# EAGLE design finalSchematics (EAGLE 7.2.0)

## Sheet 1 of 2: PWR
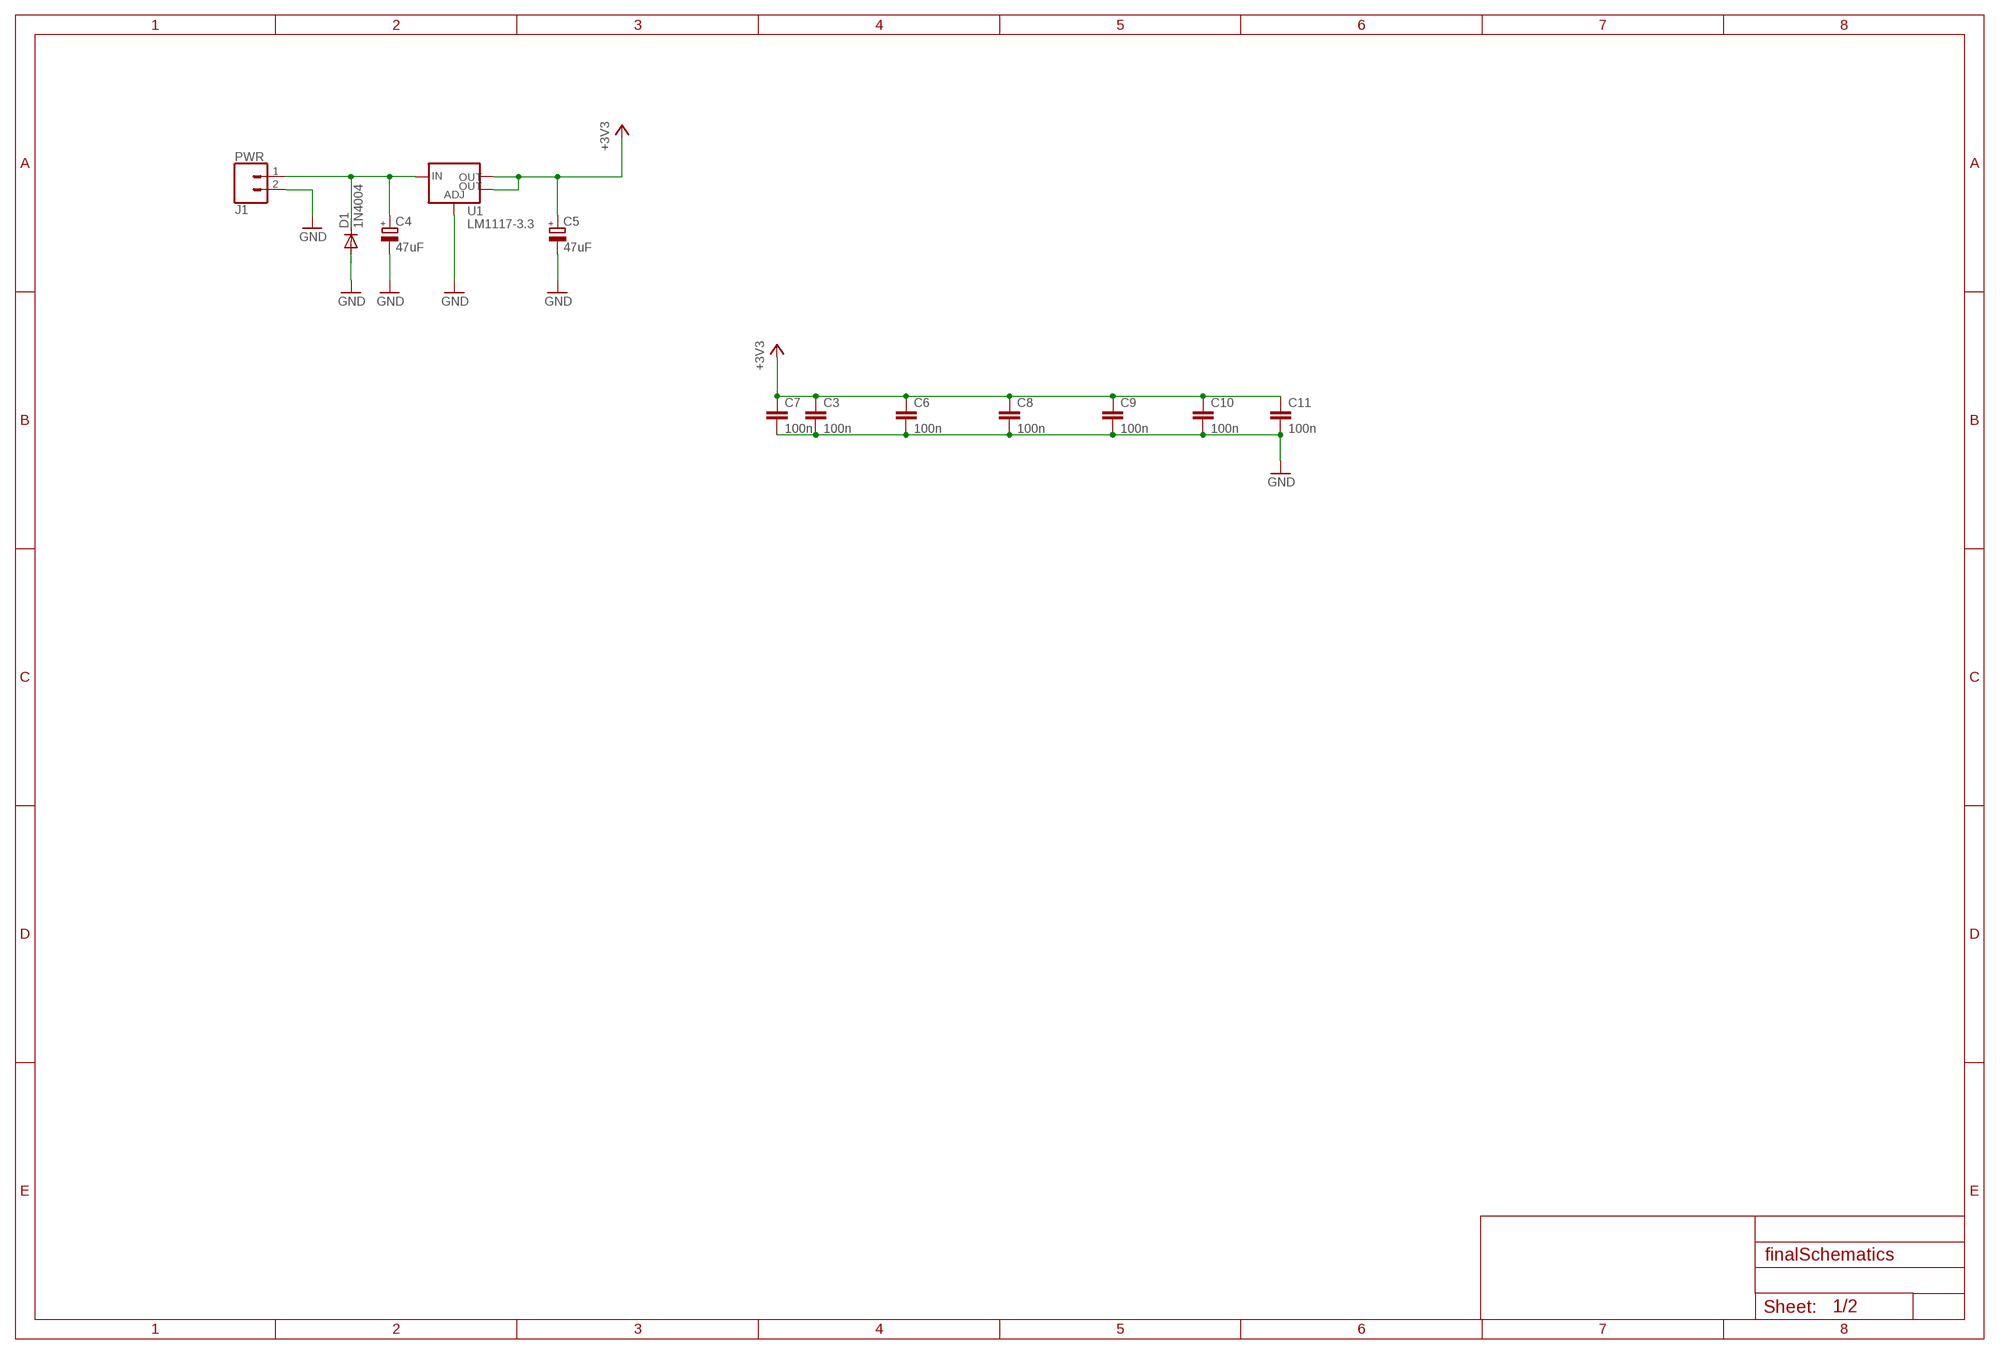
[diagram p0: schematic, sheet 1]

### Parts
C3  100n  C-EUC0805  [C0805]
C4  47uF  CPOL-EU153CLV-0810  [153CLV-0810]
C5  47uF  CPOL-EU153CLV-0810  [153CLV-0810]
C6  100n  C-EUC0805  [C0805]
C7  100n  C-EUC0805  [C0805]
C8  100n  C-EUC0805  [C0805]
C9  100n  C-EUC0805  [C0805]
C10  100n  C-EUC0805  [C0805]
C11  100n  C-EUC0805  [C0805]
D1  1N4004  [DO41-10]
J1  PWR  CONN_02  [1X02]
U1  LM1117-3.3  V_REG_LM1117SOT223  [SOT223]

### Nets
+3V3: C3.1 C5.+ C6.1 C7.1 C8.1 C9.1 C10.1 C11.1 U1.2(OUT) U1.4(OUT) ; also sheet 2
GND: C3.2 C4.- C5.- C6.2 C7.2 C8.2 C9.2 C10.2 C11.2 D1.A J1.2 U1.1(ADJ) ; also sheet 2
N$3: C4.+ D1.C J1.1 U1.3(IN)

## Sheet 2 of 2: MCU
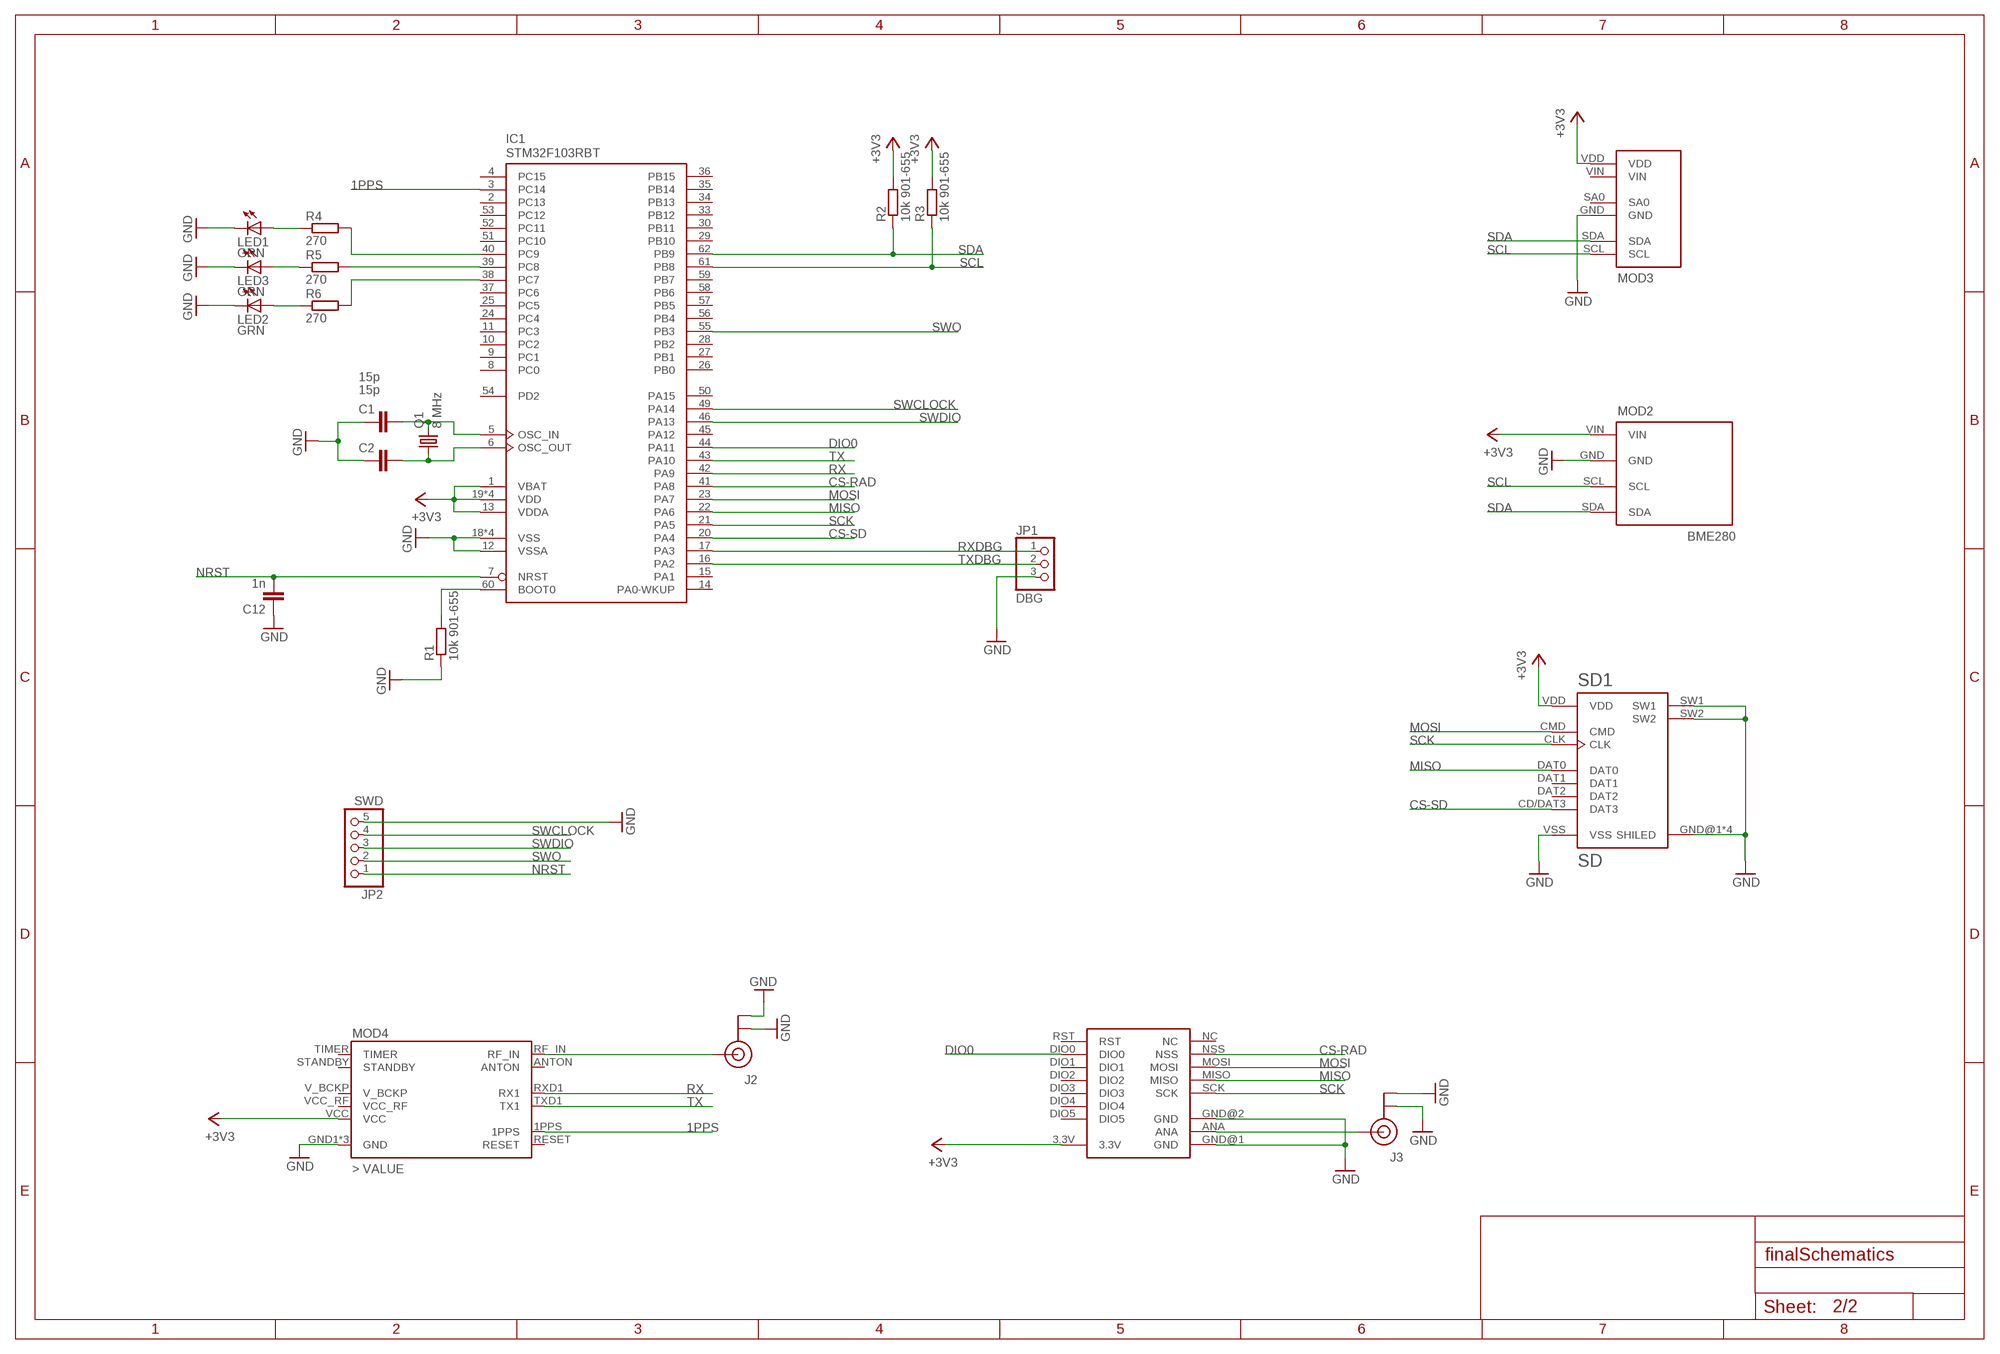
[diagram p1: schematic, sheet 2]

### Parts
C1  15p  C-EUC0805  [C0805]
C2  15p  C-EUC0805  [C0805]
C12  1n  C-EUC0805  [C0805]
IC1  STM32F103RBT  [LQFP64]
J2  U.FL  [U.FL]
J3  U.FL  [U.FL]
JP1  DBG  PINHD-1X3  [1X03]
JP2  SWD  PINHD-1X5  [1X05]
LED1  GRN  LEDCHIP-LED0603  [CHIP-LED0603]
LED2  GRN  LEDCHIP-LED0603  [CHIP-LED0603]
LED3  GRN  LEDCHIP-LED0603  [CHIP-LED0603]
MOD2  BME280  [BME280]
MOD3  IMU04A  [IMU04A]
MOD4  GPS  L70B-GPS  [L70B-GPS]
Q1  8 MHz  CRYSTALHC49UP  [HC49UP]
R1  10k 901-655  R-EU_R0805  [R0805]
R2  10k 901-655  R-EU_R0805  [R0805]
R3  10k 901-655  R-EU_R0805  [R0805]
R4  270  R-EU_R0805  [R0805]
R5  270  R-EU_R0805  [R0805]
R6  270  R-EU_R0805  [R0805]
SD1  SD  [MOLEX-SD-104031]
U$2  RFM69  [20X16BOARD]

### Nets
1PPS: IC1.3(PC14) MOD4.1PPS
+3V3: IC1.1(VBAT) IC1.13(VDDA) IC1.19(VDD) IC1.32(VDD) IC1.48(VDD) IC1.64(VDD) MOD2.VIN MOD3.VDD MOD4.VCC R2.2 R3.2 SD1.VDD U$2.3.3V ; also sheet 1
CS-RAD: IC1.41(PA8) U$2.NSS
CS-SD: IC1.20(PA4) SD1.CD/DAT3(DAT3)
DIO0: IC1.44(PA11) U$2.DIO0
GND: C1.1 C2.1 C12.1 IC1.12(VSSA) IC1.18(VSS) IC1.31(VSS) IC1.47(VSS) IC1.63(VSS) J2.P$1(GND) J2.P$2(GND) J3.P$1(GND) J3.P$2(GND) JP1.3 JP2.5 LED1.C LED2.C LED3.C MOD2.GND MOD3.GND MOD4.GND1(GND) MOD4.GND2(GND) MOD4.GND3(GND) R1.1 SD1.GND@1(SHILED) SD1.GND@2(SHILED) SD1.GND@3(SHILED) SD1.GND@4(SHILED) SD1.SW1 SD1.SW2 SD1.VSS U$2.GND@1(GND) U$2.GND@2(GND) ; also sheet 1
MISO: IC1.22(PA6) SD1.DAT0 U$2.MISO
MOSI: IC1.23(PA7) SD1.CMD U$2.MOSI
N$1: C2.2 IC1.6(OSC_OUT) Q1.1
N$2: C1.2 IC1.5(OSC_IN) Q1.2
N$5: J3.P$3(SIGNAL) U$2.ANA
N$6: J2.P$3(SIGNAL) MOD4.RF_IN
N$7: IC1.38(PC7) R6.2
N$9: IC1.39(PC8) R5.2
N$10: IC1.40(PC9) R4.2
N$11: LED1.A R4.1
N$12: LED2.A R6.1
N$13: LED3.A R5.1
N$14: IC1.60(BOOT0) R1.2
NRST: C12.2 IC1.7(NRST) JP2.1
RX: IC1.42(PA9) MOD4.RXD1(RX1)
RXDBG: IC1.17(PA3) JP1.1
SCK: IC1.21(PA5) SD1.CLK U$2.SCK
SCL: IC1.61(PB8) MOD2.SCL MOD3.SCL R3.1
SDA: IC1.62(PB9) MOD2.SDA MOD3.SDA R2.1
SWCLOCK: IC1.49(PA14) JP2.4
SWDIO: IC1.46(PA13) JP2.3
SWO: IC1.55(PB3) JP2.2
TX: IC1.43(PA10) MOD4.TXD1(TX1)
TXDBG: IC1.16(PA2) JP1.2
Unconnected: IC1.2(PC13) IC1.4(PC15) IC1.8(PC0) IC1.9(PC1) IC1.10(PC2) IC1.11(PC3) IC1.14(PA0-WKUP) IC1.15(PA1) IC1.24(PC4) IC1.25(PC5) IC1.26(PB0) IC1.27(PB1) IC1.28(PB2) IC1.29(PB10) IC1.30(PB11) IC1.33(PB12) IC1.34(PB13) IC1.35(PB14) IC1.36(PB15) IC1.37(PC6) IC1.45(PA12) IC1.50(PA15) IC1.51(PC10) IC1.52(PC11) IC1.53(PC12) IC1.54(PD2) IC1.56(PB4) IC1.57(PB5) IC1.58(PB6) IC1.59(PB7) MOD3.SA0 MOD3.VIN MOD4.ANTON MOD4.RESET MOD4.STANDBY MOD4.TIMER MOD4.V_BCKP MOD4.VCC_RF SD1.DAT1 SD1.DAT2 U$2.DIO1 U$2.DIO2 U$2.DIO3 U$2.DIO4 U$2.DIO5 U$2.RST

## Power pins joined to a net without a drawn wire
NC: U$2.NC

## Library data of the parts
C1-C3 C6-C12 = rcl:C-EU: CAPACITOR, European symbol
C4 C5 = rcl:CPOL-EU: POLARIZED CAPACITOR, European symbol
D1 = diode:1N4004: DIODE general purpose rectifier, 1 A
IC1 = components:STM32F103R*T: ARM 32-bit Cortex™-M3 CPU 72 MHz maximum frequency 16 to 1024 Kbytes of Flash memory 6 to 96 kbytes of SRAM 51 GPIOs 2.0 to 3.6 V application supply
J1 = SparkFun-Connectors:CONN_02: Multi connection point. Often used as Generic Header-pin footprint for 0.1 inch spaced/style header connections On any of the 0.1 inch spaced packages, you can populate with these: Break Away Headers - Straight <https://www.sparkfun.com/products/116> (PRT-00116) Break Away Male Headers - Right Angle <https://www.sparkfun.com/products/553> (PRT-00553) Female Headers <https://www.sparkfun.com/products/115> (PRT-00115) Break Away Headers - Machine Pin <https://www.sparkfun.com/products/117> (PRT-00117) Break Away Female Headers - Swiss Machine Pin <https://www.sparkfun.com/products/743> (PRT-00743) For SCREWTERMINALS and SPRING TERMINALS visit here: Screw Terimnals on SparkFun.com <https://www.sparkfun.com/search/results?term=Screw+Terminals> (5mm/3.5mm/2.54mm spacing) This device is also useful as a general connection point to wire up your design to another part of your project. Our various solder wires solder well into these plated through hole pads. Hook-Up Wire - Assortment (Stranded, 22 AWG) <https://www.sparkfun.com/products/11375> (PRT-11375) Hook-Up Wire - Assortment (Solid Core, 22 AWG) <https://www.sparkfun.com/products/11367> (PRT-11367) View the entire wire category on our website here <https://www.sparkfun.com/categories/141> Special notes: Molex polarized connector foot print use with: PRT-08233 with associated crimp pins and housings. 2.54_SCREWTERM for use with PRT-10571. 3.5mm Screw Terminal footprints for PRT-08084 5mm Screw Terminal footprints for use with PRT-08432
J2 J3 = SparkFun-Connectors:U.FL: SMD Antenna Connector - U.FL 2mm height, 3.0mm x 3.0mm receptacle size. SparkFun Products: SparkFun WiFi Shield - ESP8266 <https://www.sparkfun.com/products/13287> SparkFun ESP8266 Thing <https://www.sparkfun.com/products/13231> SparkFun MiniGen - Pro Mini Signal Generator Shield <https://www.sparkfun.com/products/11420>; PROD_ID: CONN-09193; SF_ID: WRL-09144
JP1 = pinhead:PINHD-1X3: PIN HEADER
JP2 = pinhead:PINHD-1X5: PIN HEADER
LED1-LED3 = led:LED: LED OSRAM: - CHIPLED LG R971, LG N971, LY N971, LG Q971, LY Q971, LO R971, LY R971 LH N974, LH R974 LS Q976, LO Q976, LY Q976 LO Q996 - Hyper CHIPLED LW Q18S LB Q993, LB Q99A, LB R99A - SideLED LS A670, LO A670, LY A670, LG A670, LP A670 LB A673, LV A673, LT A673, LW A673 LH A674 LY A675 LS A676, LA A676, LO A676, LY A676, LW A676 LS A679, LY A679, LG A679 - Hyper Micro SIDELED® LS Y876, LA Y876, LO Y876, LY Y876 LT Y87S - SmartLED LW L88C, LW L88S LB L89C, LB L89S, LG L890 LS L89K, LO L89K, LY L89K LS L896, LA L896, LO L896, LY L896 - TOPLED LS T670, LO T670, LY T670, LG T670, LP T670 LSG T670, LSP T670, LSY T670, LOP T670, LYG T670 LG T671, LOG T671, LSG T671 LB T673, LV T673, LT T673, LW T673 LH T674 LS T676, LA T676, LO T676, LY T676, LB T676, LH T676, LSB T676, LW T676 LB T67C, LV T67C, LT T67C, LS T67K, LO T67K, LY T67K, LW E67C LS E67B, LA E67B, LO E67B, LY E67B, LB E67C, LV E67C, LT E67C LW T67C LS T679, LY T679, LG T679 LS T770, LO T770, LY T770, LG T770, LP T770 LB T773, LV T773, LT T773, LW T773 LH T774 LS E675, LA E675, LY E675, LS T675 LS T776, LA T776, LO T776, LY T776, LB T776 LHGB T686 LT T68C, LB T68C - Hyper Mini TOPLED® LB M676 - Mini TOPLED Santana® LG M470 LS M47K, LO M47K, LY M47K Source: http://www.osram.convergy.de LUXEON: - LUMILED® LXK2-PW12-R00, LXK2-PW12-S00, LXK2-PW14-U00, LXK2-PW14-V00 LXK2-PM12-R00, LXK2-PM12-S00, LXK2-PM14-U00 LXK2-PE12-Q00, LXK2-PE12-R00, LXK2-PE12-S00, LXK2-PE14-T00, LXK2-PE14-U00 LXK2-PB12-K00, LXK2-PB12-L00, LXK2-PB12-M00, LXK2-PB14-N00, LXK2-PB14-P00, LXK2-PB14-Q00 LXK2-PR12-L00, LXK2-PR12-M00, LXK2-PR14-Q00, LXK2-PR14-R00 LXK2-PD12-Q00, LXK2-PD12-R00, LXK2-PD12-S00 LXK2-PH12-R00, LXK2-PH12-S00 LXK2-PL12-P00, LXK2-PL12-Q00, LXK2-PL12-R00 Source: www.luxeon.com KINGBRIGHT: KA-3528ASYC Source: www.kingbright.com
MOD2 = BME280:BME280
MOD3 = IMU:IMU04A
MOD4 = components:L70B-GPS
Q1 = crystal:CRYSTAL: CRYSTAL; OC_FARNELL: unknown; OC_NEWARK: unknown
R1-R3 = rcl:R-EU_: RESISTOR, European symbol
R4-R6 = resistor:R-EU_: RESISTOR, European symbol
SD1 = components:SD
U1 = SparkFun-IC-Power:V_REG_LM1117: Voltage Regulator LM1117 Standard adjustable voltage regulator but in SMD form. Spark Fun Electronics SKU : COM-00595; PROD_ID: VREG-08170
U$2 = RFM69mod:RFM69: RFM69 module

## Board
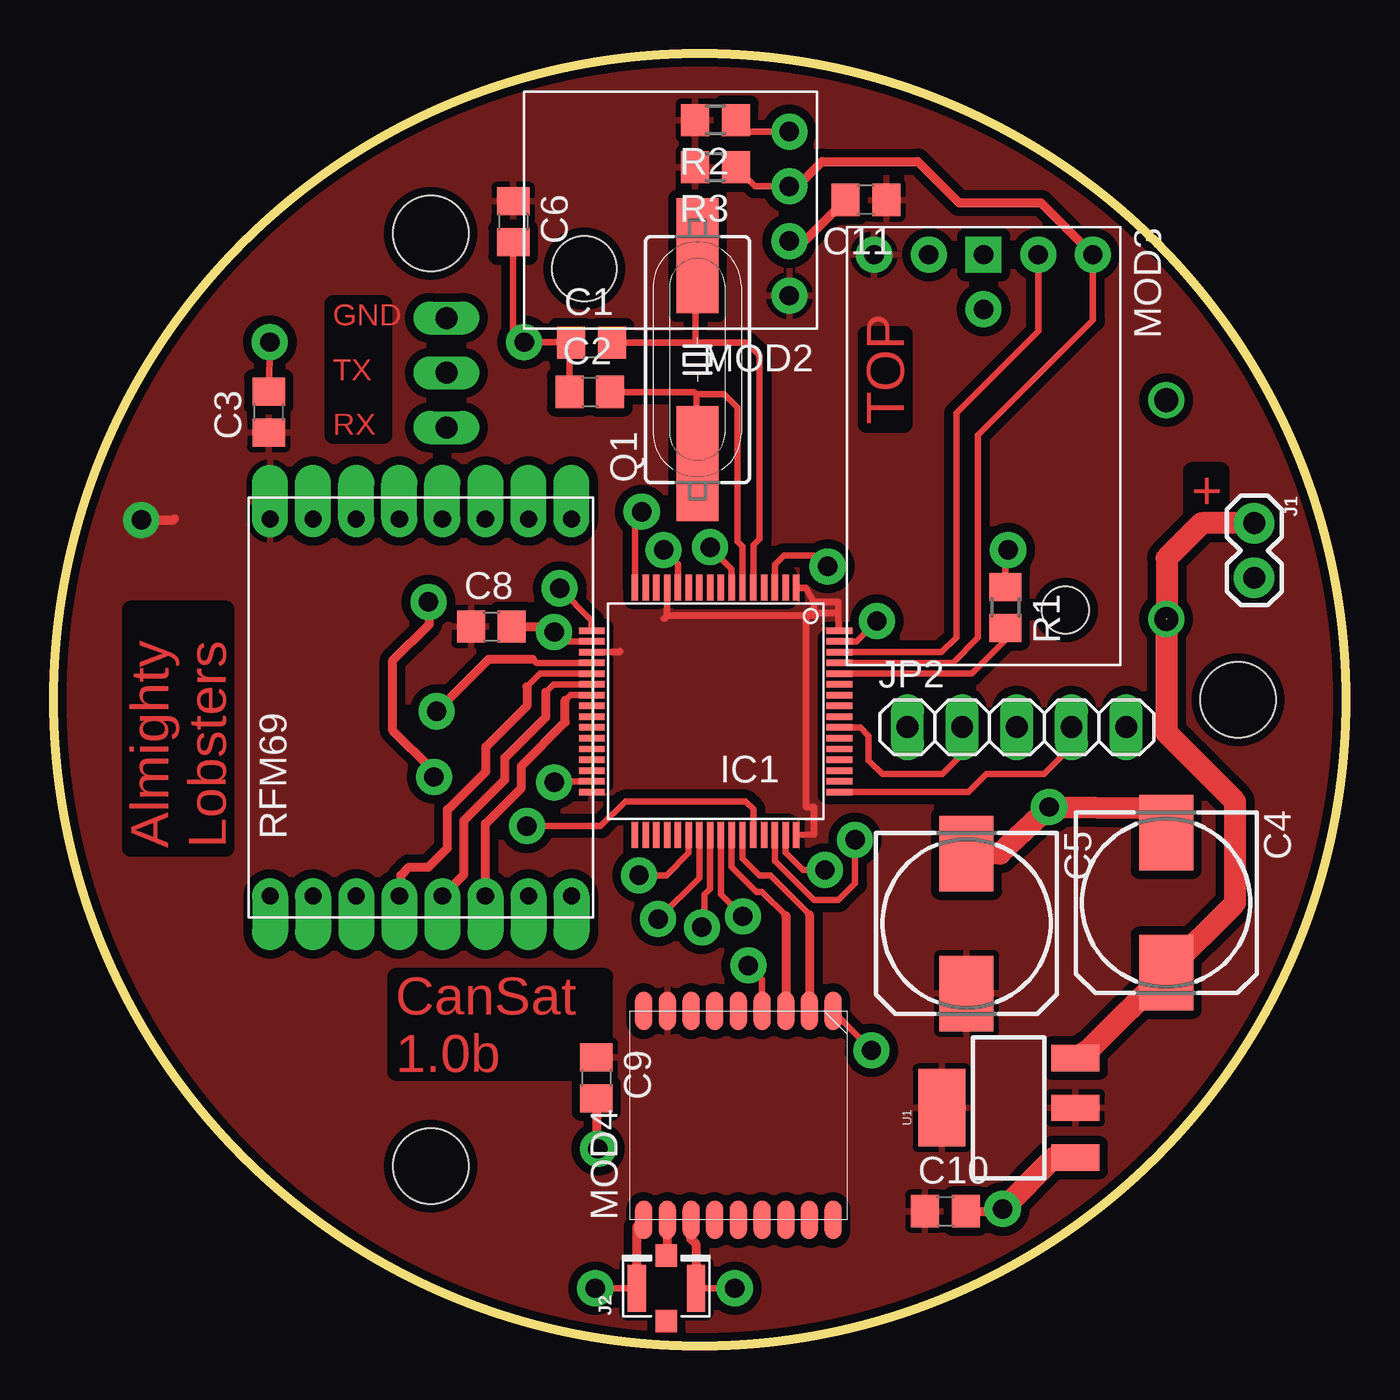
[diagram p2: board, top side]
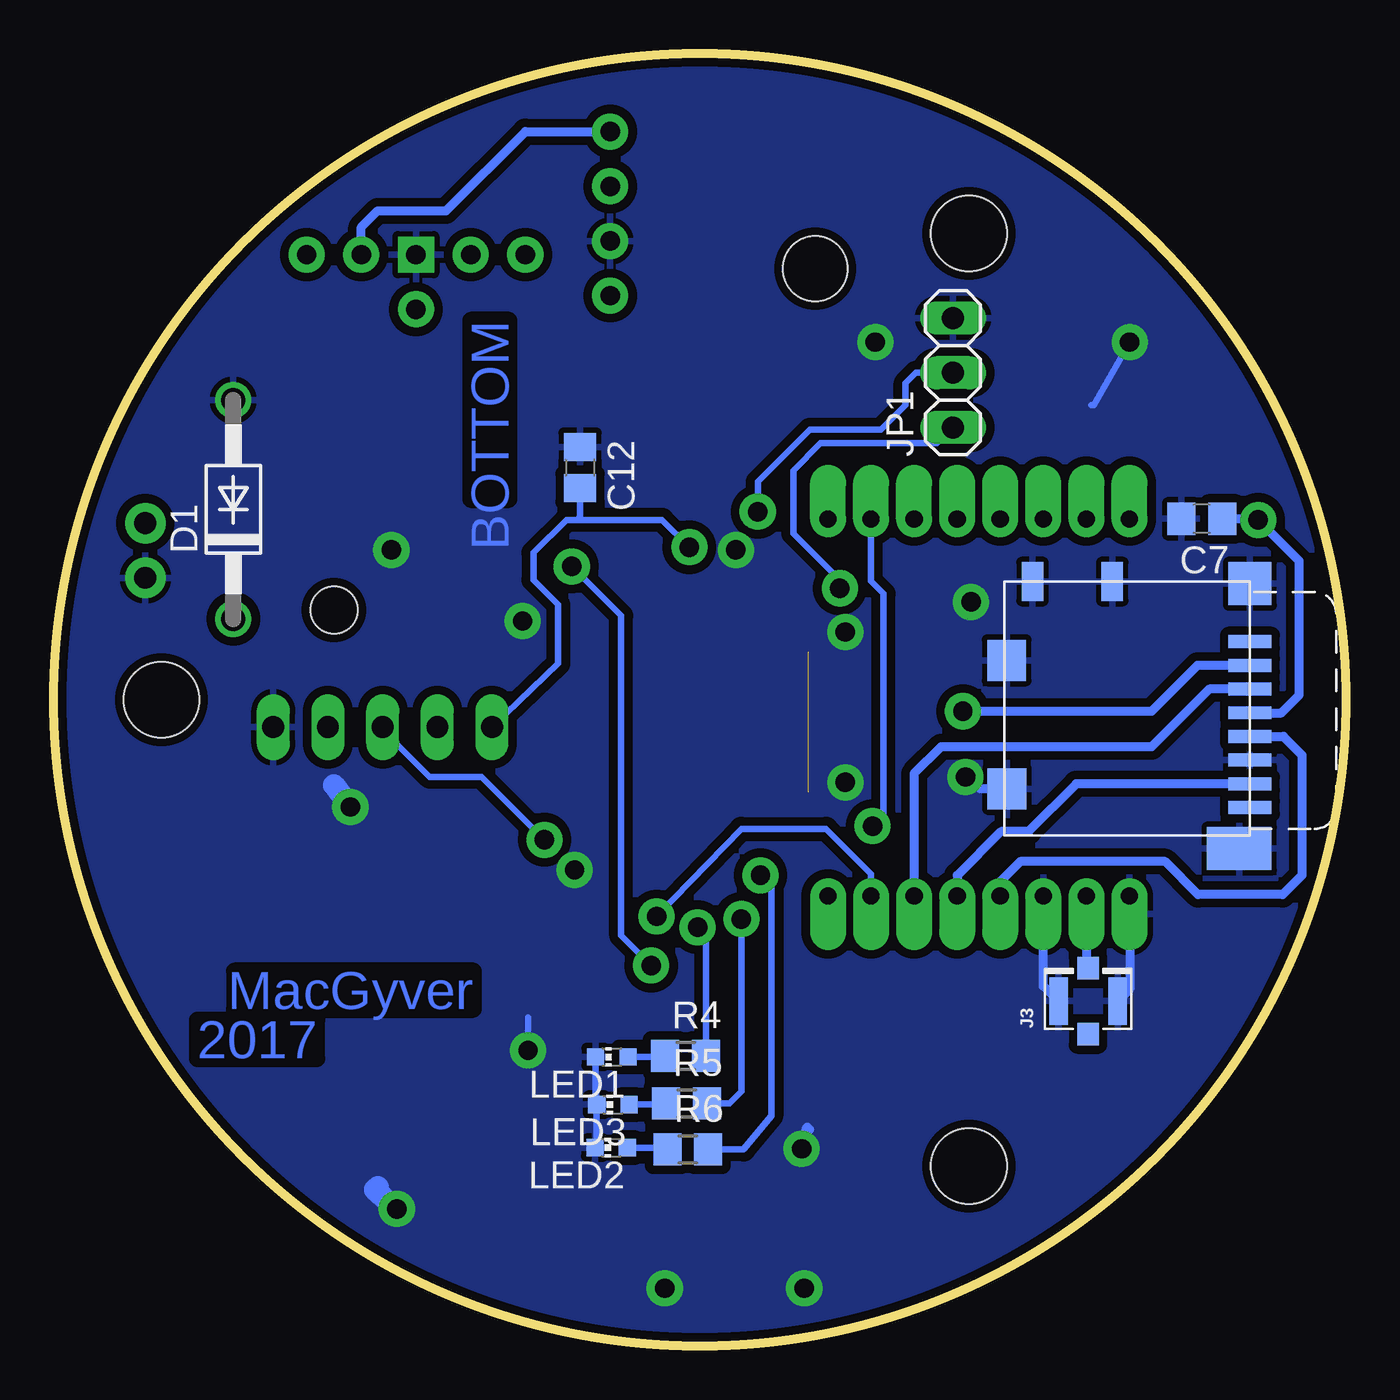
[diagram p3: board, bottom side, seen from below]

Size 60 x 60 mm. Coordinates in mm from the lower left corner, seen from the top.
Outline: circle at 30,30 radius 30
Copper layers (1*16): Top 0.035mm / dielectric 1.5mm / Bottom 0.035mm
Design rules "default *": minimum track width 6mil, minimum drill 0.6mm, track to track 6mil, track to pad 6mil, pad to pad 6mil, via to via 6mil, smd to smd 6mil, copper to edge 12mil, drill to drill 8mil, minimum pad ring 10mil, minimum via ring 8mil, stop-mask expansion 4mil, vias tented up to drill 0mil, thermal gap 10mil
Holes 3.5 mm at 55,30 17.5,51.65 17.5,8.35

### Footprints (pad centres in the part's own frame; a part is rotated, then mirrored left to right if it is on the bottom)
C0805 = smd 1.3 x 1.5: 1 -0.95,0; 2 0.95,0
153CLV-0810 = smd 3.5 x 2.5: + 3.25,0; - -3.25,0
DO41-10 = drill 1.118: A 5.08,0; C -5.08,0
LQFP64 = smd 0.3 x 1.2: 1 -3.75,-5.75; 2 -3.25,-5.75; 3 -2.75,-5.75; 4 -2.25,-5.75; 5 -1.75,-5.75; 6 -1.25,-5.75; 7 -0.75,-5.75; 8 -0.25,-5.75; 9 0.25,-5.75; 10 0.75,-5.75; 11 1.25,-5.75; 12 1.75,-5.75; 13 2.25,-5.75; 14 2.75,-5.75; 15 3.25,-5.75; 16 3.75,-5.75; 33 3.75,5.75; 34 3.25,5.75; 35 2.75,5.75; 36 2.25,5.75; 37 1.75,5.75; 38 1.25,5.75; 39 0.75,5.75; 40 0.25,5.75; 41 -0.25,5.75; 42 -0.75,5.75; 43 -1.25,5.75; 44 -1.75,5.75; 45 -2.25,5.75; 46 -2.75,5.75; 47 -3.25,5.75; 48 -3.75,5.75 | smd 1.2 x 0.3: 17 5.75,-3.75; 18 5.75,-3.25; 19 5.75,-2.75; 20 5.75,-2.25; 21 5.75,-1.75; 22 5.75,-1.25; 23 5.75,-0.75; 24 5.75,-0.25; 25 5.75,0.25; 26 5.75,0.75; 27 5.75,1.25; 28 5.75,1.75; 29 5.75,2.25; 30 5.75,2.75; 31 5.75,3.25; 32 5.75,3.75; 49 -5.75,3.75; 50 -5.75,3.25; 51 -5.75,2.75; 52 -5.75,2.25; 53 -5.75,1.75; 54 -5.75,1.25; 55 -5.75,0.75; 56 -5.75,0.25; 57 -5.75,-0.25; 58 -5.75,-0.75; 59 -5.75,-1.25; 60 -5.75,-1.75; 61 -5.75,-2.25; 62 -5.75,-2.75; 63 -5.75,-3.25; 64 -5.75,-3.75
1X02 = drill 1.016 pad 1.88: 1 0,0; 2 2.54,0
U.FL = smd 2.2 x 0.85: P$1 0,1.375; P$2 0,-1.375 | smd 1.05 x 1: P$3 1.525,0; P$4 -1.525,0
1X03 = drill 1.016 long: 1 -2.54,0; 2 0,0; 3 2.54,0
1X05 = drill 1.016 long: 1 -5.08,0; 2 -2.54,0; 3 0,0; 4 2.54,0; 5 5.08,0
CHIP-LED0603 = smd 0.8 x 0.8: A 0,-0.75; C 0,0.75
BME280 = drill 0.9 pad 1.676: GND 1.27,6.35; SCL 1.27,3.81; SDA 1.27,1.27; VIN 1.27,8.89 | hole 3: 10.797,7.63
IMU04A = drill 0.9 pad 1.676 square: GND 0,0 | drill 0.9 pad 1.676: SA0 2.54,0; SCL 0,5.08; SDA 0,2.54; VDD 0,-5.08; VIN 0,-2.54 | hole 2.18: 16.51,3.81
L70B-GPS = smd 1.8 x 0.8: 1PPS 9.7,3.3; ANTON 0,5.5; GND1 0,8.8; GND2 0,6.6; GND3 9.7,0; NC1 0,3.3; NC2 9.7,6.6; R1 0,2.2; R2 0,1.1; RESET 9.7,8.8; RF_IN 0,7.7; RXD1 9.7,2.2; STANDBY 9.7,4.4; TIMER 0,0; TXD1 9.7,1.1; V_BCKP 9.7,5.5; VCC 9.7,7.7; VCC_RF 0,4.4
HC49UP = smd 5.334 x 1.93: 1 -4.826,0; 2 4.826,0
R0805 = smd 1.3 x 1.5: 1 -0.95,0; 2 0.95,0
MOLEX-SD-104031 = smd 0.6 x 2: CD/DAT3 2.005,0; CLK -1.295,0; CMD 0.905,0; DAT0 -3.495,0; DAT1 -4.595,0; DAT2 3.105,0; VDD -0.195,0; VSS -2.395,0 | smd 2 x 3: GND@1 -6.5,0.5 | smd 2 x 2: GND@2 5.8,0 | smd 1.9 x 1.8: GND@3 -3.73,11.29; GND@4 2.24,11.3 | smd 1.8 x 1: SW1 5.9,10.1; SW2 5.9,6.4
SOT223 = smd 1.219 x 2.235: 1 -2.311,-3.099; 2 0,-3.099; 3 2.311,-3.099 | smd 3.6 x 2.2: 4 0,3.099
20X16BOARD = drill 0.8 pad 1.676 offset: 3.3V -9,-7; ANA 8.5,-5; DIO0 -9,5; DIO1 -9,3; DIO2 -9,1; DIO3 -9,-1; DIO4 -9,-3; DIO5 -9,-5; GND@1 8.5,-7; GND@2 8.5,-3; MISO 8.5,1; MOSI 8.5,3; NC 8.5,7; NSS 8.5,5; RST -9,7; SCK 8.5,-1

### Placement (x,y rotation side)
C1  24.97,46.58 0 top
C2  24.89,44.3 0 top
C3  9.98,43.36 90 top
C4  51.66,20.57 270 top
C5  42.39,19.61 270 top
C6  21.34,52.2 270 top
C7  6.68,38.4 180 bottom
C8  20.32,33.4 0 top
C9  25.2,12.45 270 top
C10  41.4,6.25 0 top
C11  37.72,53.21 180 top
C12  35.56,40.79 270 bottom
D1  51.66,38.84 90 bottom
IC1  30.73,29.46 180 top
J1  55.75,38.2 270 top
J2  28.45,2.67 90 top
J3  11.96,16 90 bottom
JP1  18.24,45.19 90 bottom
JP2  44.73,28.73 0 top
LED1  34.09,13.41 90 bottom
LED2  34.11,9.19 90 bottom
LED3  34.04,11.2 90 bottom
MOD2  35.43,57.66 180 top
MOD3  43.18,50.67 270 top
MOD4  36.2,5.84 90 top
Q1  29.9,45.8 90 top
R1  44.2,34.29 270 top
R2  30.73,56.92 180 top
R3  30.73,54.74 180 top
R4  30.66,13.46 0 bottom
R5  30.61,11.25 0 bottom
R6  30.56,9.12 0 bottom
SD1  4.45,29.59 90 bottom
U1  44.35,11.05 90 top
U$2  17.04,29.39 270 top

### Tracks (layer width: path | path; a pad name or v marks a point on that pad's centre or on a via)
1PPS  (via drill 0.9 pad 1.68)
  Top 0.305: MOD4.1PPS 32.9,15.75 32.89,15.75 32.89,17.02 v32.26,17.65 | v35.94,36.2 35.94,36.07 35.31,36.7 33.91,36.7 33.48,36.28 IC1.3
  Bottom 0.305: v32.26,17.65 33.66,19.05 33.66,33.91 v35.94,36.2
+3V3  (via drill 0.9 pad 1.68)  (1 unrouted)
  Top 0.305: IC1.19 26.25,32.21 arc90 26.29,32.26 | 28.48,33.95 arc-90 28.32,33.78 | IC1.13 28.48,33.95 | 28.48,33.95 28.45,33.91 35.31,33.91 35.31,34.54 | 35.31,34.54 34.92,35.18 34.48,35.18 IC1.1 | IC1.64 36.45,33.21 36.45,34.04 | 36.45,34.04 36.45,34.54 35.31,34.54 | IC1.48 35.31,23.75 35.31,25.02 34.92,25.02 34.92,34.04 36.45,34.04
  Top 0.406: 4.06,38.86 v4.06,38.35 5.55,38.35 5.6,38.41
  Bottom 0.406: SD1.VDD 2.99,29.4 2.16,30.23 2.16,36.45 v4.06,38.35 4.12,38.41 C7.1
  pour Top (isolate 0.4): 68.58,66.55 68.58,-8.64 -9.02,-8.64 -9.02,66.67
CS-RAD  (via drill 0.9 pad 1.68)
  Top 0.305: IC1.41 30.98,20.96 v32,19.94
  Bottom 0.305: v32,19.94 28.07,24 24.13,24 22.04,21.92 U$2.NSS
CS-SD  (via drill 0.9 pad 1.68)
  Top 0.305: IC1.20 22.44,31.71 22.23,31.88
  Top 0.406: 22.23,31.88 20.19,31.88 v17.78,29.46
  Bottom 0.406: SD1.CD/DAT3 6.88,31.6 9.02,29.46 v17.78,29.46
DIO0  (via drill 0.9 pad 1.68)
  Top 0.305: IC1.44 32.48,24.92 32.13,25.27 26.54,25.27 25.4,24.13 v21.97,24.13
  Bottom 0.305: v21.97,24.13 21.46,24.64 21.46,34.92 22.04,35.51 U$2.DIO0
GND  (via drill 0.9 pad 1.68)
  Top 0.305: IC1.31 23.29,26.21 v23.24,26.16 | IC1.18 23.67,32.71 v23.24,33.15 | IC1.12 28.98,36.29 v28.32,36.96 | IC1.63 37.29,32.71 v38.23,33.66 | IC1.47 33.98,22.91 34.8,22.1 v35.81,22.1 | MOD4.GND3 36.24,15.49 v37.97,13.72 | J2.P$1 v25.15,2.67 | J2.P$2 v31.62,2.67 | R1.1 44.2,36.7 v44.32,36.96 | C3.2 10,44.32 v10.03,46.61 | C2.1 23.94,46.51 C1.1 23.99,46.61 v21.84,46.61 21.34,47.12 C6.2
  Top 0.406: MOD4.GND1 27.07,5.52 J2.P$1 | C10.2 44.04,6.25 v44.07,6.35 | C9.2 25.2,9.32 v25.27,9.14 | C8.2 22.99,33.4 v23.24,33.15 | MOD2.GND 34.86,51.31 C11.2 | v17.65,26.42 17.53,26.8 15.74,28.58 SD1.GND@4 17.44,33.53 v17.4,34.54 | MOD4.GND2 29.59,4.95 29.82,4.72 J2.P$2
  Top 1.016: U1.1 46.46,8.74 v44.07,6.35 | 51.61,23.88 C4.- 50.6,24.97 v46.23,25.02 43.94,22.86 C5.-
  Bottom 0.305: LED2.C 34.79,9.27 LED3.C 34.84,11.25 LED1.C | v23.24,26.16 23.11,26.04 | v23.24,33.15 22.99,33.4 | v28.32,36.96 28.19,37.21 | v38.23,33.66 38.23,33.78 | v37.97,13.72 37.97,15.24 | v25.15,2.67 25.53,2.79 | v31.62,2.67 31.37,3.17 | v10.03,46.61 11.68,43.69 11.81,43.69
  Bottom 0.406: U$2.GND@1 10.04,20.84 10.03,20.83 10.03,16.56 J3.P$2 | J3.P$1 14.04,16.71 U$2.GND@2 | v25.27,9.14 25.02,10.16 24.89,10.03 | SD1.GND@3 16.97,25.86 v17.65,26.42 | v17.4,34.54 17.53,33.91
  Bottom 1.016: v44.07,6.35 45.09,7.24 44.96,7.37 | 46.99,26.04 v46.23,25.02
  pour Bottom (isolate 0.4): -9.02,66.93 -9.02,-8.64 68.58,-8.64 68.58,66.93
MISO
  Top 0.305: IC1.22 23.22,30.71 22.86,30.35
  Top 0.406: U$2.MISO 19.05,21.89 19.05,24.38 20.95,26.29 20.95,27.3 22.86,29.21 22.86,30.35
  Bottom 0.406: SD1.DAT0 12.51,26.1 14.73,23.88 16,23.88 18.03,21.84 U$2.MISO
MOSI
  Top 0.305: IC1.23 23.99,30.21 23.75,29.97
  Top 0.406: U$2.MOSI 20.04,24.23 21.72,25.91 21.72,26.92 23.75,28.96 23.75,29.97
  Bottom 0.406: SD1.CMD 6.33,30.5 9.02,27.81 18.8,27.81 20.04,26.57 U$2.MOSI
N$1
  Top 0.305: 30.48,39.37 29.97,39.37 Q1.1 29.84,41.02 29.84,44.2 | IC1.6 31.98,37.1 31.75,37.34 31.75,43.56 31.11,44.2 29.84,44.2 | C2.2 29.74,44.3 29.84,44.2
  Top 0.406: 29.84,39.5 arc90 Q1.1
N$2
  Top 0.305: IC1.5 32.48,37.18 32.77,37.47 32.77,45.97 32.16,46.58 29.84,46.58 | C1.2 29.84,46.58 | 29.81,50.49 29.81,46.62 29.84,46.58
  Top 0.406: Q1.2 29.81,50.49
N$3  (1 unrouted)
  Top 1.016: U1.3 48.21,13.87 C4.+ 51.66,17.37 54.86,20.57 54.86,25.27 51.69,28.45 51.69,33.73 | J1.1 53.31,38.2 51.69,36.58 51.69,33.78 D1.C
N$5
  Bottom 0.406: U$2.ANA 12.04,17.61 J3.P$3
N$6
  Top 0.406: J2.P$3 28.5,4.11 MOD4.RF_IN
N$7  (via drill 0.9 pad 1.68)
  Top 0.305: IC1.38 29.48,22.88 28.45,21.84 v27.18,21.84
  Bottom 0.305: v27.18,21.84 26.67,21.34 26.67,10.67 27.96,9.12 R6.2
N$9  (via drill 0.9 pad 1.68)
  Top 0.305: IC1.39 29.98,21.73 v28.07,19.81
  Bottom 0.305: v28.07,19.81 28.07,11.81 28.63,11.25 R5.2
N$10  (via drill 0.9 pad 1.68)
  Top 0.305: IC1.40 30.48,21.21 30.23,20.95 30.23,19.56 v30.1,19.43
  Bottom 0.305: v30.1,19.43 29.71,19.04 R4.2
N$11
  Bottom 0.305: R4.1 31.66,13.41 LED1.A
N$12
  Bottom 0.305: R6.1 31.58,9.2 LED2.A
N$13
  Bottom 0.305: R5.1 31.61,11.2 LED3.A
N$14
  Top 0.305: IC1.60 42.64,31.21 44.2,32.77 R1.2
NRST  (via drill 0.9 pad 1.68)
  Top 0.305: IC1.7 31.48,36.08 v30.48,37.08
  Bottom 0.305: JP2.1 36.58,31.67 36.58,34.42 37.72,35.56 37.72,36.83 36.2,38.35 35.69,38.35 | v30.48,37.08 31.75,38.35 35.69,38.35 | C12.2 35.56,38.48 35.69,38.35
RX
  Top 0.305: IC1.42 31.48,22.24 32.64,21.08 32.89,21.08 33.99,19.98
  Top 0.406: 33.99,19.98 MOD4.RXD1
RXDBG  (via drill 0.9 pad 1.68)
  Top 0.305: IC1.17 24.98,33.69 v23.5,35.18
  Bottom 0.305: v23.5,35.18 23.5,35.56 25.65,37.72 25.65,40.64 24.38,41.91 18.97,41.91 JP1.1
SCK
  Top 0.305: IC1.21 22.58,31.21 21.97,30.61
  Top 0.406: U$2.SCK 16.13,20.97 16.13,21.84 16.51,22.23 17.4,22.23 18.29,23.11 18.29,24.89 20.07,26.67 20.07,27.81 21.97,29.72 21.97,30.61
  Bottom 0.406: SD1.CLK 2.9,28.3 2.03,27.43 2.03,21.84 2.92,20.95 6.86,20.95 8.38,22.48 15.11,22.48 16,21.59 16,20.93 U$2.SCK
SCL
  Top 0.305: IC1.61 41.75,31.71 42.93,32.89 42.93,42.29 48.26,47.62 MOD3.SCL | R3.1 32.57,53.85 MOD2.SCL
  Top 0.406: MOD2.SCL 34.54,53.85 35.69,54.99 40.13,54.99 42.04,53.09 45.85,53.09 MOD3.SCL
SDA
  Top 0.305: IC1.62 41.23,32.21 41.91,32.89 41.91,43.31 45.72,47.12 MOD3.SDA | R2.1 32.22,56.39 MOD2.SDA
  Bottom 0.406: MOD3.SDA 45.72,51.94 44.96,52.7 41.78,52.7 38.1,56.39 MOD2.SDA
SWCLOCK
  Top 0.305: IC1.49 42.48,25.71 43.31,26.54 45.97,26.54 47.24,27.81 47.24,28.7 JP2.4
SWDIO  (via drill 0.9 pad 1.68)
  Top 0.305: IC1.46 33.48,22.52 35.31,20.7 36.45,20.7 37.21,21.46 v37.21,23.5
  Bottom 0.305: v37.21,23.5 40.13,26.42 42.55,26.42 44.73,28.6 JP2.3
SWO
  Top 0.305: IC1.55 37.45,28.71 37.85,28.32 37.85,27.18 38.48,26.54 41.27,26.54 42.16,27.43 42.16,28.7 JP2.2
TX
  Top 0.305: 35.09,20.02 33.27,21.84 32.77,21.84 31.98,22.63 IC1.43
  Top 0.406: 35.09,20.02 MOD4.TXD1
TXDBG  (via drill 0.9 pad 1.68)
  Top 0.305: IC1.16 26.98,38.29 v27.3,38.73
  Bottom 0.305: v27.3,38.73 27.3,40.13 24.89,42.55 21.59,42.55 20.45,43.69 20.45,44.7 19.96,45.19 JP1.2

### Text on the board
Top: TOP | GND / TX / RX | + | Almighty / Lobsters | CanSat / 1.0b
Bottom: BOTTOM | MacGyver | 2017
tStop: tSTOP
bStop: bSTOP